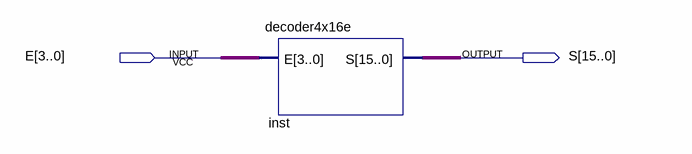
[diagram p0: schematic sheet]
// Quartus schematic decoder.bdf as structural Verilog: 1 symbols, 2 pins
module decoder (
  input  [3:0] E,
  output [15:0] S
);

  decoder4x16e inst (.E(E), .S(S));
endmodule
